# Altium schematic sheet ADC Chip.SchDoc
size A4; Author: Thomas Kreppel; CompanyName: Universidad de Santiago de Chile; Address1: Avenida Ecuador Nº 3519; Address2: Estación Central, Santiago; Address3: Chile; DocumentNumber: 3; SheetNumber: 3; SheetTotal: 6
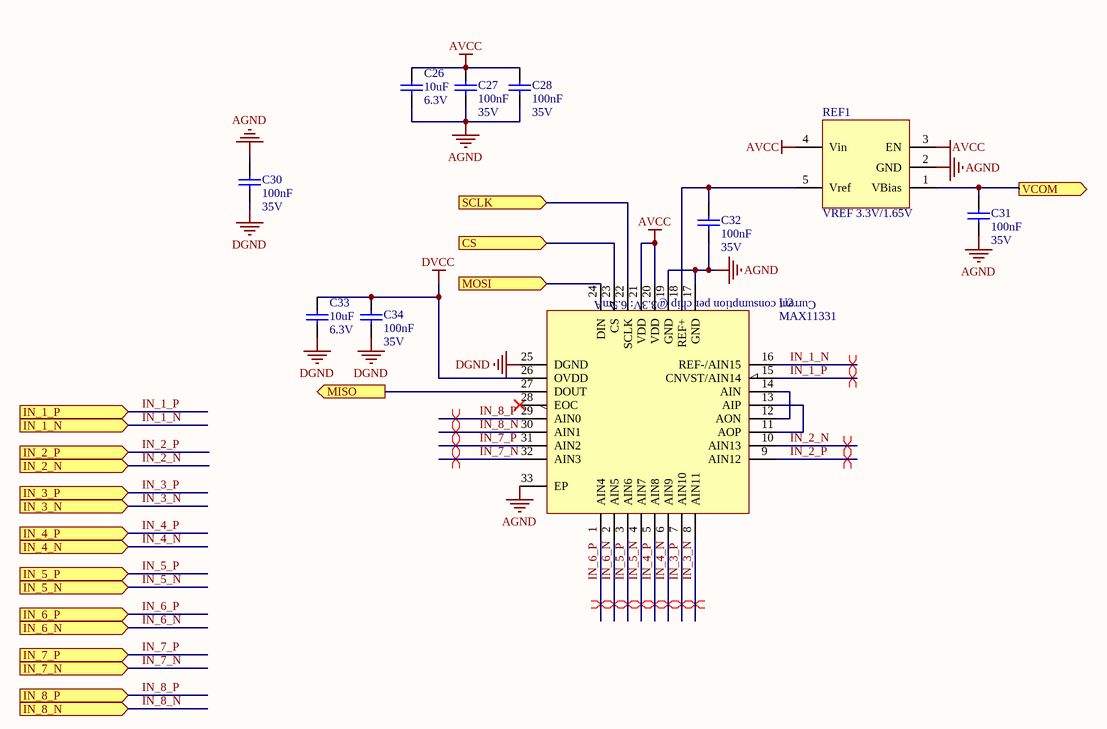
[diagram p0: ADC Chip.SchDoc]

## Parts
C26  10uF  Voltage: 6.3V  [CAP_0603]
C27  100nF  Voltage: 35V  [CAP_0603]
C28  100nF  Voltage: 35V  [CAP_0603]
C30  100nF  Voltage: 35V  [CAP_0603]
C31  100nF  Voltage: 35V  [CAP_0603]
C32  100nF  Voltage: 35V  [CAP_0603]
C33  10uF  Voltage: 6.3V  [CAP_0603]
C34  100nF  Voltage: 35V  [CAP_0603]
REF1  VREF 3.3V/1.65V  [SOT-23-5]
U2  MAX11331  [QFN50P500X500X80-33N-310]

## Ports
CS (in), IN_1_N (in), IN_1_P (in), IN_2_N (in), IN_2_P (in), IN_3_N (in), IN_3_P (in), IN_4_N (in), IN_4_P (in), IN_5_N (in), IN_5_P (in), IN_6_N (in), IN_6_P (in), IN_7_N (in), IN_7_P (in), IN_8_N (in), IN_8_P (in), MISO (out), MOSI (in), SCLK (in), VCOM (out)

## Nets
AGND: C26.2 C27.2 C28.2 C30.1 C31.2 C32.2 REF1.2(GND) U2.17(GND) U2.19(GND) U2.33(EP)
AVCC: C26.1 C27.1 C28.1 REF1.3(EN) REF1.4(Vin) U2.20(VDD) U2.21(VDD)
DGND: C30.2 C33.2 C34.2 U2.25(DGND)
DVCC: C33.1 C34.1 U2.26(OVDD)
CS: U2.23(CS) ; port CS
IN_1_N: U2.16(REF-/AIN15) ; port IN_1_N
IN_1_P: U2.15(CNVST/AIN14) ; port IN_1_P
IN_2_N: U2.10(AIN13) ; port IN_2_N
IN_2_P: U2.9(AIN12) ; port IN_2_P
IN_3_N: U2.8(AIN11) ; port IN_3_N
IN_3_P: U2.7(AIN10) ; port IN_3_P
IN_4_N: U2.6(AIN9) ; port IN_4_N
IN_4_P: U2.5(AIN8) ; port IN_4_P
IN_5_N: U2.4(AIN7) ; port IN_5_N
IN_5_P: U2.3(AIN6) ; port IN_5_P
IN_6_N: U2.2(AIN5) ; port IN_6_N
IN_6_P: U2.1(AIN4) ; port IN_6_P
IN_7_N: U2.32(AIN3) ; port IN_7_N
IN_7_P: U2.31(AIN2) ; port IN_7_P
IN_8_N: U2.30(AIN1) ; port IN_8_N
IN_8_P: U2.29(AIN0) ; port IN_8_P
MISO: U2.27(DOUT) ; port MISO
MOSI: U2.24(DIN) ; port MOSI
SCLK: U2.22(SCLK) ; port SCLK
VCOM: C31.1 REF1.1(VBias) ; port VCOM
NetC32_1: C32.1 REF1.5(Vref) U2.18(REF+)
NetU2_11: U2.11(AOP) U2.13(AIP)
NetU2_12: U2.12(AON) U2.14(AIN)

Not connected (* = marked no-connect by the designer): U2 28(EOC)*

## Layout directives
differential pair: IN_1_N, IN_1_P, IN_2_N, IN_2_P, IN_3_N, IN_3_P, IN_4_N, IN_4_P, IN_5_N, IN_5_P, IN_6_N, IN_6_P, IN_7_N, IN_7_P, IN_8_N, IN_8_P

## Notes on the sheet
- Current consumption per chip @3.3V: 6.5mA
- Title
- Size:
- Date:
- A4
- Revision:
- Time:
- Sheet
- of
- Author:
- Project:

## Library data of the parts
C26 C33 = Cap_0603: Capacitor Ceramic; MPN: JMK107ABJ106MA-T; MF: Tayo Yuden; Tolerance: 10%; Dielectricum: X7R; Supplier Part Number 1: 587-5869-1-ND; Value: 10uF; Supplier 1: Digikey; Package: 0603; LCSC Part Number: C268008
C27 C28 C30-C32 C34 = Cap_0603: Capacitor; MPN: C0603C104M5RACTU; Rule: PcbType=ProtelPcb; MF: KEMET; Dielectricum: X7R; Tolerance: 10%; Published: 8-Jun-2000; LatestRevisionDate: 17-Jul-2002; LatestRevisionNote: Re-released for DXP Platform.; PackageReference: RAD-0.3; Publisher: Altium Limited; Value: 100nF; Supplier Part Number 1: 399-7845-1-ND; Supplier 1: Digikey; Package: 0603; LCSC Part Number: C14663
REF1 = VREF 3.3V/1.65V: MPN: REF2033AIDDCT; MF: Texas Instruments; Supplier Part Number 1: 296-40487-1-ND; Supplier 1: Digikey; LCSC Part Number: C181409
U2 = MAX11331: ADC 12 bits SPI; Manufacturer Part-Number: MAX11331ATJ+; Digikey Part-Number: MAX11331ATJ+-ND; LCSC Part Number: C1543252